# EAGLE design StyroCutter-555-heatsink-5V (EAGLE 7.2.0)
Styro Cutter PWM controller based on 556
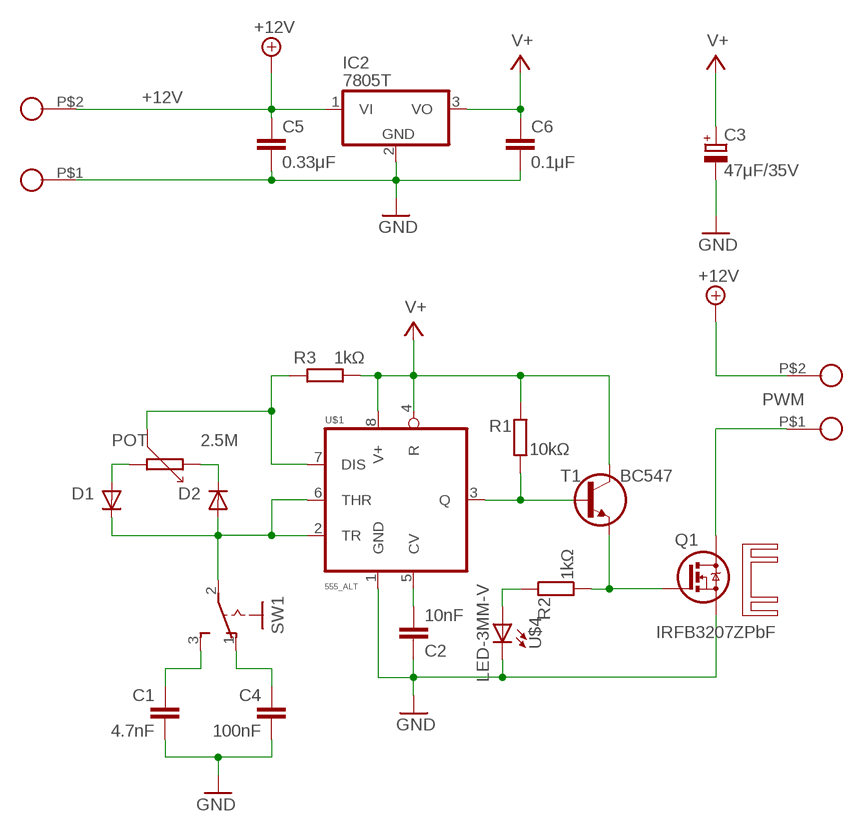
[diagram p0: schematic, sheet 1]

## Parts
C1  4.7nF  C050-020X036  [C050-020X036]
C2  10nF  C050-020X036  [C050-020X036]
C3  47μF/35V  CPOL-EUE2.5-5  [E2,5-5]
C4  100nF  C050-020X036  [C050-020X036]
C5  0.33μF  C050-024X044  [C050-024X044]
C6  0.1μF  C050-024X044  [C050-024X044]
D1  1N4148  1N414834-7  [DO34-7]
D2  1N4148  1N414834-7  [DO34-7]
IC2  7805T  [TO220H]
J1  TERM-2  [SCREWTERM-2]
J2  TERM-2  [SCREWTERM-2]
POT  2.5M  PIHER-PT16S  [PC16S]
Q1  IRFB3207ZPbF  PMOSFET_NTO220BV  [TO220BV]
R1  10kΩ  R0204/12  [0204/12]
R2  1kΩ  R0204/10  [0204/10]
R3  1kΩ  R0202/2V  [0202/2V]
SW1  SL-SW-1P-2T-V  [SLSW-1P2T-V]
T1  BC547  BC547CBE  [TO92-CBE]
U$1  555_ALT  [DIL08]
U$2  AQ-SO  [AQ_HS_3A_SO]
U$4  LED-3MM-V  [LED-3MM-V]

## Nets
+12V: C5.1 IC2.1(VI) J1.P$2 J2.P$2
GND: C1.2 C2.1 C3.- C4.2 C5.2 C6.2 IC2.2(GND) J1.P$1 Q1.S U$1.1(GND) U$4.C
N$1: D2.C POT.1A
N$2: D1.A POT.1E
N$3: R1.1 T1.B U$1.3(Q)
N$4: C4.1 SW1.1(O)
N$5: C2.2 U$1.5(CV)
N$6: POT.1S R3.1 U$1.7(DIS)
N$7: Q1.G R2.1 T1.E
N$8: D1.C D2.A SW1.2(P) U$1.2(TR) U$1.6(THR)
N$9: C1.1 SW1.3(S)
N$11: R2.2 U$4.A
PWM: J2.P$1 Q1.D
V+: C3.+ C6.1 IC2.3(VO) R1.2 R3.2 T1.C U$1.4(R) U$1.8(V+)

## Library data of the parts
C1 C2 C4-C6 = c:C: CAPACITOR, European symbol
C3 = rcl:CPOL-EU: POLARIZED CAPACITOR, European symbol
D1 D2 = d:1N4148
IC2 = linear:78*: Positive VOLTAGE REGULATOR Source: http://cache.national.com/ds/LM/LM78L05.pdf http://www.fairchildsemi.com/ds/LM/LM7805.pdf
J1 J2 = pinconn:TERM-2
POT = piher-pt16:PIHER-PT16S
Q1 = power-mosfet:PMOSFET_N: Power MOSFET N-Channel
R1-R3 = r:R: RESISTOR, European symbol
SW1 = sw:SL-SW-1P-2T
T1 = t:BC547
U$1 = ic:*555_ALT
U$2 = heatsink:AQ
U$4 = led:LED

## Net classes
0 GND: width 1.219 mm, clearance 0.635 mm

## Board
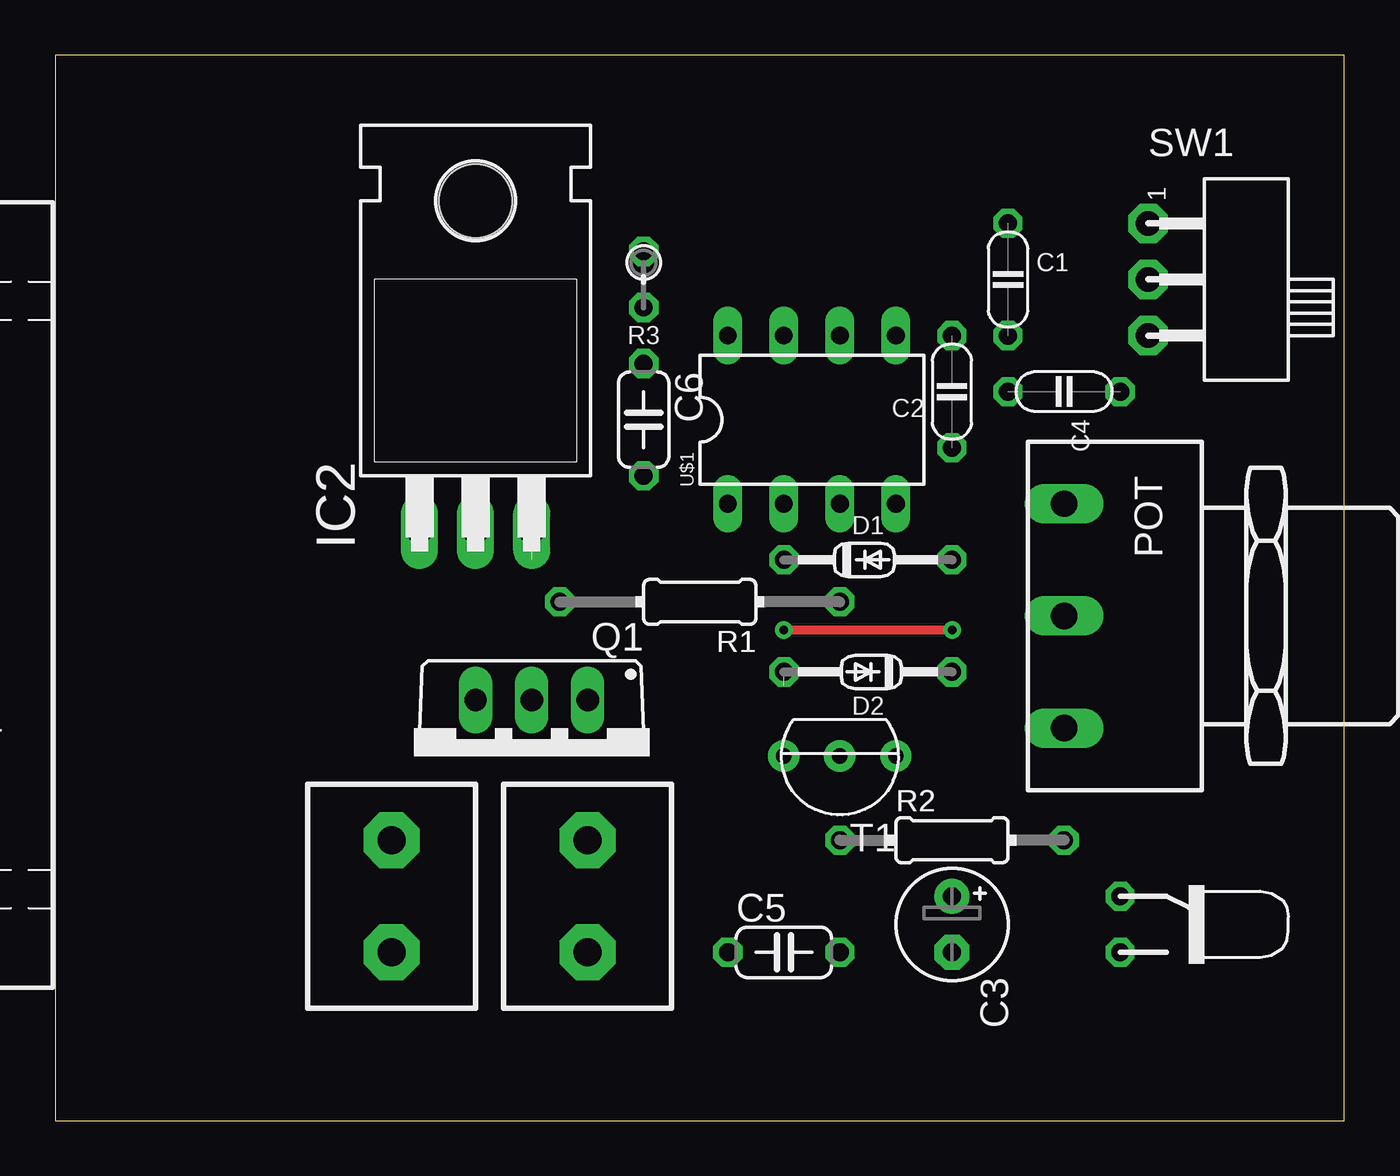
[diagram p1: board, top side]
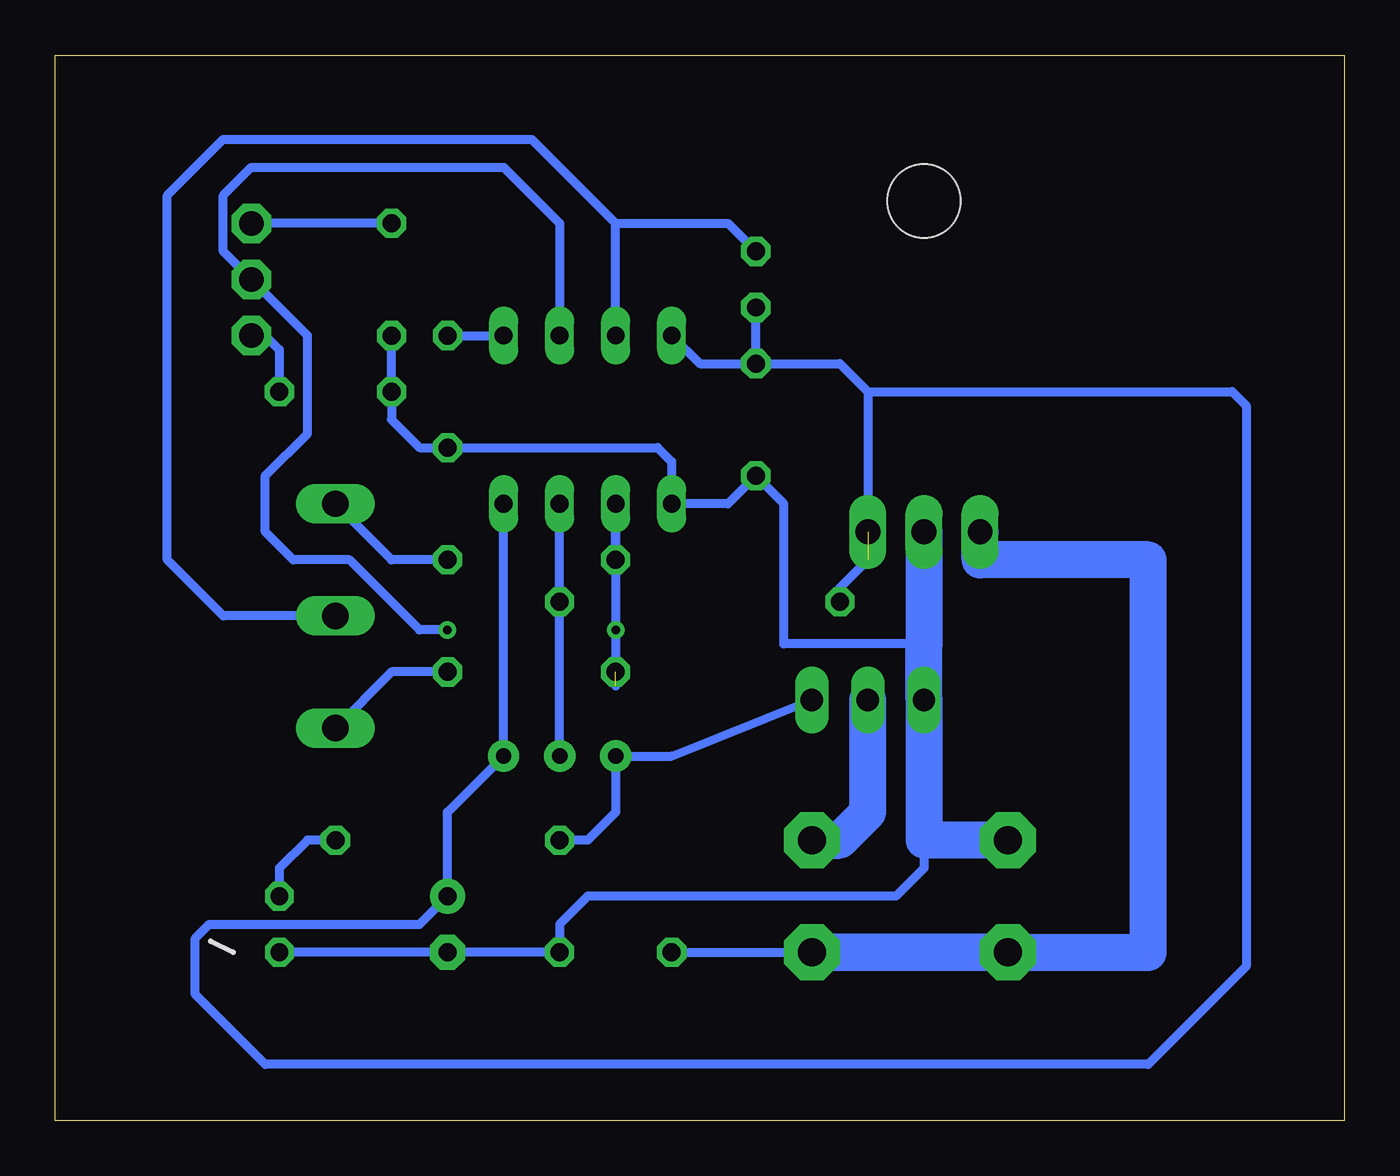
[diagram p2: board, bottom side, seen from below]

Size 58.42 x 48.26 mm. Coordinates in mm from the lower left corner, seen from the top.
Outline: 0,0 58.42,0 58.42,48.26 0,48.26 0,0
Copper layers (1*16): Top 0.035mm / dielectric 1.5mm / Bottom 0.035mm
Design rules "default": minimum track width 10mil, minimum drill 24mil, track to track 8mil, track to pad 8mil, pad to pad 8mil, via to via 8mil, smd to smd 8mil, copper to edge 40mil, drill to drill 8mil, minimum pad ring 10mil, minimum via ring 8mil, stop-mask expansion 4mil, vias tented up to drill 0mil, thermal gap 10mil

### Footprints (pad centres in the part's own frame; a part is rotated, then mirrored left to right if it is on the bottom)
C050-020X036 = drill 0.813 octagon: 1 0,2.54; 2 0,-2.54
E2,5-5 = drill 0.813 pad 1.6: + -1.27,0 | drill 0.813 pad 1.6 octagon: - 1.27,0
C050-024X044 = drill 0.813 octagon: 1 -2.54,0; 2 2.54,0
DO34-7 = drill 0.813 octagon: A 3.81,0; C -3.81,0
TO220H = drill 1.118 long: 1 -2.54,-10.16; 2 0,-10.16; 3 2.54,-10.16 | hole 3.302: 0,4.826
SCREWTERM-2 = drill 1.27 pad 2.54 octagon: P$1 -2.54,0; P$2 2.54,0
PC16S = drill 1.2 long: 1A -5.08,2.54; 1E 5.08,2.54; 1S 0,2.54
TO220BV = drill 1.016 long: D 0,-2.54; G -2.54,-2.54; S 2.54,-2.54
0204/12 = drill 0.813 octagon: 1 -6.35,0; 2 6.35,0
0204/10 = drill 0.813 octagon: 1 -5.08,0; 2 5.08,0
0202/2V = drill 0.813 octagon: 1 0,-1.27; 2 0,1.27
SLSW-1P2T-V = drill 1.118 pad 1.778 octagon: 1 -5.08,-2.54; 2 -5.08,0; 3 -5.08,2.54
TO92-CBE = drill 0.7 pad 1.422: B 0,0; C -2.54,0; E 2.54,0
DIL08 = drill 0.8 pad 1.27 long: 1 -3.81,3.81; 2 -3.81,1.27; 3 -3.81,-1.27; 4 -3.81,-3.81; 5 3.81,-3.81; 6 3.81,-1.27; 7 3.81,1.27; 8 3.81,3.81
LED-3MM-V = drill 0.8 octagon: A 0,1.27; C 0,-1.27

### Placement (x,y rotation side)
C1  43.18,38.1 0 top
C2  40.64,33.02 180 top
C3  40.64,8.89 270 top
C4  45.72,33.02 270 top
C5  33.02,7.62 0 top
C6  26.67,31.75 270 top
D1  36.83,25.4 0 top
D2  36.83,20.32 180 top
IC2  19.05,36.83 0 top
J1  15.24,10.16 270 top
J2  24.13,10.16 270 top
POT  48.26,22.86 90 top
Q1  21.59,16.51 180 top
R1  29.21,23.5 180 top
R2  40.64,12.7 0 top
R3  26.67,38.1 180 top
SW1  54.61,38.1 0 top
T1  35.56,16.51 180 top
U$1  34.29,31.75 90 top
U$2  -2.54,24.13 90 top
U$4  48.26,8.89 0 top

### Tracks (layer width: path | path; a pad name or v marks a point on that pad's centre or on a via)
+12V
  Bottom 0.406: C5.1 J2.P$2
  Bottom 1.676: J1.P$2 J2.P$2 8.89,7.62 8.89,25.4 16.51,25.4 IC2.1
GND
  Bottom 0.406: U$4.C C3.- C5.2 35.56,8.89 34.29,10.16 20.32,10.16 19.05,11.43 19.05,12.7 | 19.05,21.59 25.4,21.59 25.4,27.94 C6.2 27.94,27.94 U$1.1 30.48,29.84 31.11,30.48 C2.1 41.91,30.48 43.18,31.75 C4.2 C1.2
  Bottom 1.676: J1.P$1 19.05,12.7 Q1.S 19.05,21.59 IC2.2
N$1
  Bottom 0.406: D2.C 43.18,20.32 POT.1A
N$2
  Bottom 0.406: D1.A 43.18,25.4 POT.1E
N$3
  Bottom 0.406: T1.B R1.1 U$1.3
N$4
  Bottom 0.406: SW1.1 48.89,35.56 48.26,34.92 C4.1
N$5
  Bottom 0.406: C2.2 U$1.5
N$6
  Bottom 0.406: POT.1S 50.8,22.86 53.34,25.4 53.34,41.91 50.8,44.45 36.83,44.45 33.02,40.64 | U$1.7 33.02,40.64 | 33.02,40.64 27.94,40.64 R3.1
N$7
  Bottom 0.406: R2.1 34.29,12.7 33.02,13.97 T1.E 30.48,16.51 Q1.G
N$8  (via drill 0.38)  (1 unrouted)
  Top 0.406: v33.02,22.23 v40.64,22.23
  Bottom 0.406: D1.C U$1.2 v33.02,22.23 33.02,19.68 | U$1.6 35.56,40.64 38.1,43.18 49.53,43.18 50.8,41.91 50.8,39.37 SW1.2 46.99,35.56 46.99,31.11 48.89,29.21 48.89,26.67 47.62,25.4 45.08,25.4 41.91,22.23 v40.64,22.23
N$9
  Bottom 0.406: C1.1 SW1.3
N$11
  Bottom 0.406: R2.2 46.99,12.7 48.26,11.43 U$4.A
PWM
  Bottom 1.676: J2.P$1 22.86,12.7 21.59,13.97 Q1.D
V+  (1 unrouted)
  Bottom 0.406: U$1.4 T1.C 40.64,13.97 C3.+ 41.91,8.89 51.44,8.89 52.07,8.26 52.07,5.71 48.89,2.54 8.89,2.54 4.45,6.99 4.45,32.38 5.08,33.02 21.59,33.02 | C6.1 22.86,34.29 21.59,33.02 | 21.59,33.02 IC2.3 | R1.2 22.86,24.13 21.59,25.4 | C6.1 R3.2 | U$1.8 29.21,34.29 C6.1